# Altium schematic sheet DMX512+6A鋰電充電測試.SchDoc
size A4
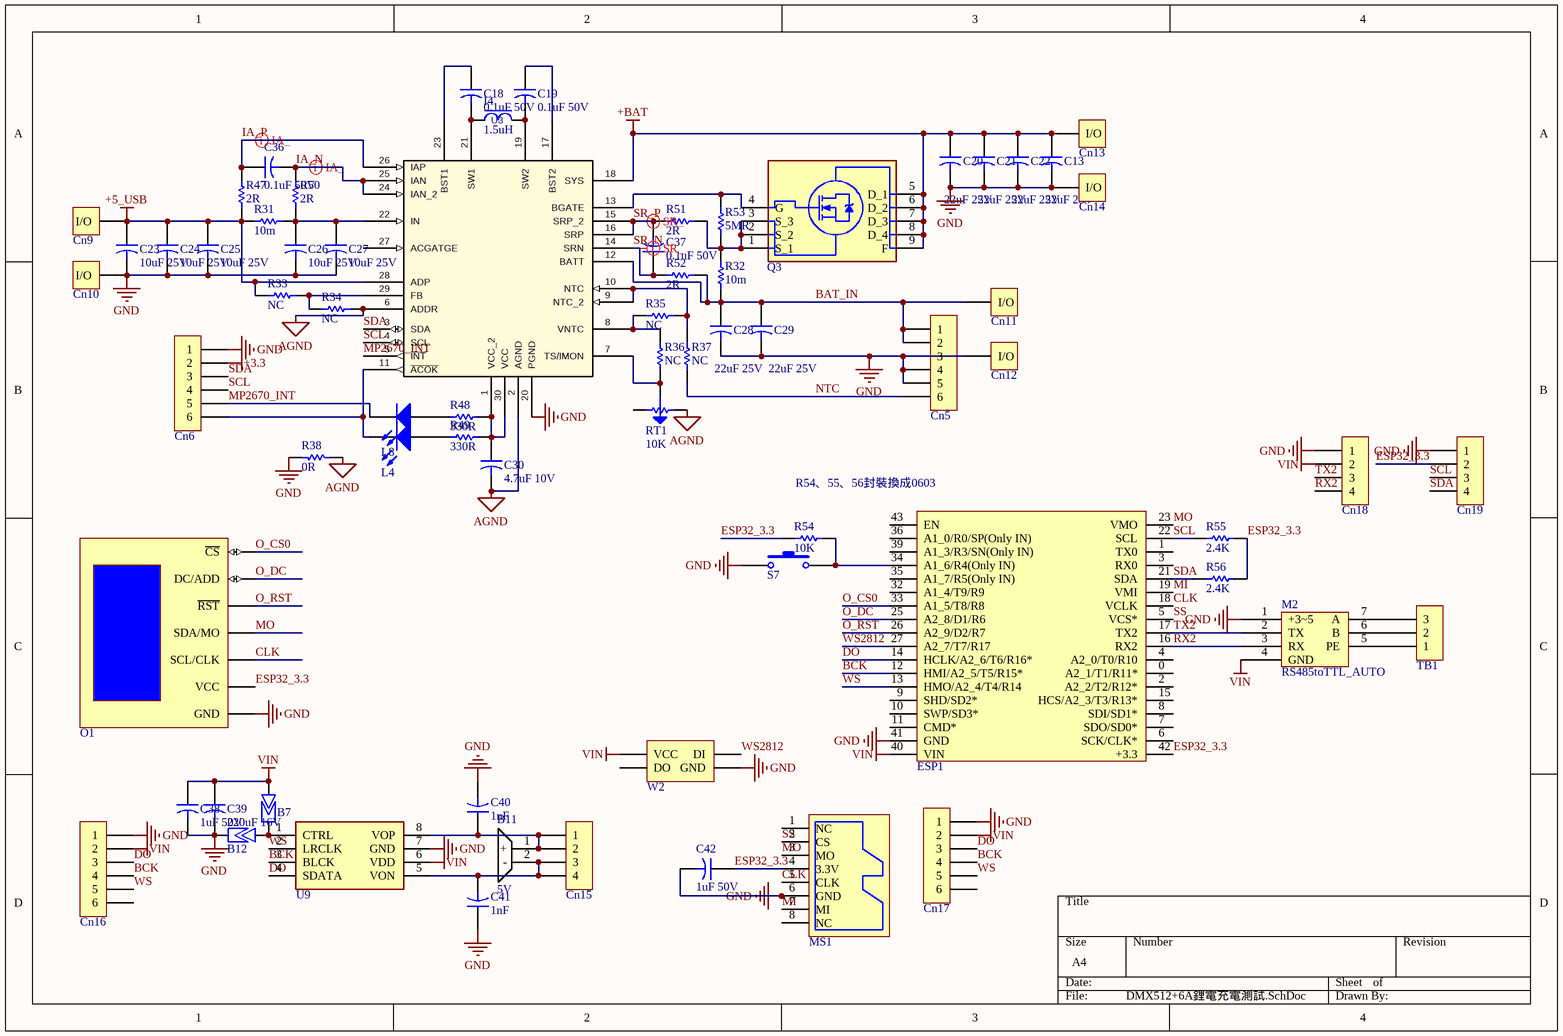
[diagram p0: DMX512+6A鋰電充電測試.SchDoc]

## Parts
B7  不上錫  [BYPASS-0402]  (value not drawn)
B11  5V  [Buzzer_12085]
B12  上錫  [BYPASS-0402]  (value not drawn)
C13  22uF 25V  [Cap SMD-0805]
C18  0.1uF 50V  [Cap SMD-0603]
C19  0.1uF 50V  [Cap SMD-0603]
C20  22uF 25V  [Cap SMD-0805]
C21  22uF 25V  [Cap SMD-0805]
C22  22uF 25V  [Cap SMD-0805]
C23  10uF 25V  [Cap SMD-0805]
C24  10uF 25V  [Cap SMD-0805]
C25  10uF 25V  [Cap SMD-0805]
C26  10uF 25V  [Cap SMD-0805]
C27  10uF 25V  [Cap SMD-0805]
C28  22uF 25V  [Cap SMD-0805]
C29  22uF 25V  [Cap SMD-0805]
C30  4.7uF 10V  [Cap SMD-0603]
C36  0.1uF 50V  [Cap SMD-0603]
C37  0.1uF 50V  [Cap SMD-0603]
C38  1uF 50V  [Cap SMD-0603]
C39  220uF 16V  [CAP SMD-B3528]
C40  1nF  [Cap SMD-0603]
C41  1nF  [Cap SMD-0603]
C42  1uF 50V  [Cap SMD-0603]
Cn5  KF2510-6  [KF2510-6A]  (value not drawn)
Cn6  KF2510-6  [KF2510-6A]  (value not drawn)
Cn9  Contact  [Terminal_Screw]  (value not drawn)
Cn10  Contact  [Terminal_Screw]  (value not drawn)
Cn11  Contact  [Terminal_Screw]  (value not drawn)
Cn12  Contact  [Terminal_Screw]  (value not drawn)
Cn13  Contact  [Terminal_Screw]  (value not drawn)
Cn14  Contact  [Terminal_Screw]  (value not drawn)
Cn15  KF2510-4  [KF2510-4A]  (value not drawn)
Cn16  KF2510-6  [KF2510-6A]  (value not drawn)
Cn17  KF2510-6  [KF2510-6A]  (value not drawn)
Cn18  KF2510-4  [KF2510-4A]  (value not drawn)
Cn19  KF2510-4  [KF2510-4A]  (value not drawn)
ESP1  ESP32_Node32s  [ESP32 Module]  (value not drawn)
I4  1.5uH  [Inductor-1040]
L4  藍  [LED SMD-0603]  (value not drawn)
L8  藍  [LED SMD-0603]  (value not drawn)
M2  RS485toTTL_AUTO  [RS485_AUTO MODULE]
MS1  SD Socket Micro  [SD  CARD SOCKET_Micro]  (value not drawn)
O1  排母 1*7P  [OLED-SPI/I2C]  (value not drawn)
Q3  BSC030N08NS5ATMA1  [TDSON-8]  (value not drawn)
R31  10m  [Res-0201]
R32  10m  [Res-0201]
R33  NC  [Res-0201]
R34  NC  [Res-0201]
R35  NC  [Res-0201]
R36  NC  [Res-0201]
R37  NC  [Res-0201]
R38  0R  [Res-0201]
R47  2R  [Res-0201]
R48  330R  [Res-0201]
R49  330R  [Res-0201]
R50  2R  [Res-0201]
R51  2R  [Res-0201]
R52  2R  [Res-0201]
R53  5MR  [Res-0201]
R54  10K  [Res-0201]
R55  2.4K  [Res-0201]
R56  2.4K  [Res-0201]
RT1  10K  [Res SMD-EVM3ESX50B]
S7  Switch  [Switch SMD-3.6*6*2.5]  (value not drawn)
TB1  HT508R-5.08 _3P  [Terminal block(KF2EDGR-5.08 _3P)]  (value not drawn)
U3  MP2760GVT-010A  [TQFN-30_MP2760_MNP]  (value not drawn)
U9  NS4168  [SOP-8]  (value not drawn)
W2  WS2812B  [LED SMD-WS2812B]  (value not drawn)

## Nets
+3.3: Cn6.2
+5_USB: C23.1 C24.1 C25.1 Cn9.1(I/O) R31.1 R33.1 R47.1 U3.28(ADP)
+BAT: C13.1 C20.1 C21.1 C22.1 Cn13.1(I/O) Q3.5(D_1) Q3.6(D_2) Q3.7(D_3) Q3.8(D_4) Q3.9(F) U3.18(SYS)
AGND: C30.2 R34.2 R38.2 RT1.1 U3.2(AGND) U3.6(ADDR)
GND: B12.1 C13.2 C20.2 C21.2 C22.2 C23.2 C24.2 C25.2 C26.2 C27.2 C28.2 C29.2 C38.2 C39.2 C40.2 C41.1 C42.2 Cn5.3 Cn5.4 Cn5.5 Cn6.1 Cn10.1(I/O) Cn12.1(I/O) Cn14.1(I/O) Cn16.1 Cn17.1 Cn18.1 Cn19.1 ESP1.41(GND) M2.1(+3~5) MS1.6(GND) O1.1(GND) R38.1 S7.1 U3.20(PGND) U9.7(GND) W2.3(GND)
VIN: B7.2 C38.1 C39.1 Cn16.2 Cn17.2 Cn18.2 ESP1.40(VIN) M2.4(GND) U9.6(VDD) W2.1(VCC)
BAT_IN: C28.1 C29.1 Cn5.1 Cn5.2 Cn11.1(I/O) R32.1 R52.1 U3.12(BATT)
BCK: Cn16.4 Cn17.4 ESP1.12(HMI/A2_5/T5/R15*) U9.3(BLCK)
CLK: ESP1.18(VCLK) MS1.5(CLK) O1.3(SCL/CLK)
DO: Cn16.3 Cn17.3 ESP1.14(HCLK/A2_6/T6/R16*) U9.4(SDATA)
ESP32_3.3: C42.1 Cn19.2 ESP1.42(+3.3) MS1.4(3.3V) O1.2(VCC) R54.1 R55.2 R56.2
IA_N: C36.2 R50.2 U3.24(IAN_2) U3.25(IAN)
IA_P: C36.1 R47.2 U3.26(IAP)
MI: ESP1.19(VMI) MS1.7(MI)
MO: ESP1.23(VMO) MS1.3(MO) O1.4(SDA/MO)
MP2670_INT: Cn6.5 L8.1(K) U3.5(~{INT})
NTC: Cn5.6 R37.1
O_CS0: ESP1.33(A1_5/T8/R8) O1.7(~{CS})
O_DC: ESP1.25(A2_8/D1/R6) O1.6(DC/ADD)
O_RST: ESP1.26(A2_9/D2/R7) O1.5(~{RST})
RX2: Cn18.4 ESP1.16(RX2) M2.3(RX)
SCL: Cn6.4 Cn19.3 ESP1.22(SCL) R55.1 U3.4(SCL)
SDA: Cn6.3 Cn19.4 ESP1.21(SDA) R56.1 U3.3(SDA)
SR_N: C37.1 R52.2 U3.14(SRN)
SR_P: C37.2 R51.2 U3.15(SRP_2) U3.16(SRP)
SS: ESP1.5(VCS*) MS1.2(CS)
TX2: Cn18.3 ESP1.17(TX2) M2.2(TX)
WS: Cn16.5 Cn17.5 ESP1.13(HMO/A2_4/T4/R14) U9.2(LRCLK)
WS2812: ESP1.27(A2_7/T7/R17) W2.4(DI)
NetB7_1: B7.1 B12.2 U9.1(CTRL)
NetB11_1: B11.1(+) C40.1 Cn15.1 Cn15.2 U9.8(VOP)
NetB11_2: B11.2(-) C41.2 Cn15.3 Cn15.4 U9.5(VON)
NetC18_1: C18.1 U3.23(BST1)
NetC18_2: C18.2 I4.1 U3.21(SW1)
NetC19_1: C19.1 U3.17(BST2)
NetC19_2: C19.2 I4.2 U3.19(SW2)
NetC26_1: C26.1 C27.1 R31.2 R50.1 U3.22(IN)
NetC30_1: C30.1 R48.1 R49.2 U3.1(VCC_2) U3.30(VCC)
NetCn6_6: Cn6.6 L4.1(K) U3.11(~{ACOK})
NetESP1_34: ESP1.34(A1_6/R4(Only_IN)) R54.2 S7.2
NetL4_2: L4.2(A) R49.1
NetL8_2: L8.2(A) R48.2
NetM2_5: M2.5(PE) TB1.1
NetM2_6: M2.6(B) TB1.2
NetM2_7: M2.7(A) TB1.3
NetQ3_1: Q3.1(S_1) Q3.2(S_2) Q3.3(S_3) R32.2 R51.1 R53.1
NetQ3_4: Q3.4(G) R53.2 U3.13(BGATE)
NetR33_2: R33.2 R34.1 U3.29(FB)
NetR35_1: R35.1 R36.2 U3.8(VNTC)
NetR35_2: R35.2 R37.2 U3.9(NTC_2) U3.10(NTC)
NetR36_1: R36.1 RT1.3(TAP) U3.7(TS/IMON)

Not connected (* = marked no-connect by the designer): Cn16 6; Cn17 6; ESP1 0(A2_1/T1/R11*) 1(TX0) 2(A2_2/T2/R12*) 3(RX0) 4(A2_0/T0/R10) 6(SCK/CLK*) 7(SDO/SD0*) 8(SDI/SD1*) 9(SHD/SD2*) 10(SWP/SD3*) 11(CMD*) 15(HCS/A2_3/T3/R13*) 32(A1_4/T9/R9) 35(A1_7/R5(Only_IN)) 36(A1_0/R0/SP(Only_IN)) 39(A1_3/R3/SN(Only_IN)) 43(EN); MS1 1(NC) 8(NC); RT1 2; U3 27(ACGATGE); W2 2(DO)

## Layout directives
differential pair: IA_N, IA_P, SR_N, SR_P

## Notes on the sheet
- R54、55、56封裝換成0603

## Library data of the parts
B7 B12 = Bypass: 短路焊點
B11 = Buzzer: 無源蜂鳴器
C13 C18-C30 C36-C42 = Cap: 電容
  C23-C27 C30 C36 C37: ComponentLink1Description: datasheet; ComponentLink1URL: chrome-extension://efaidnbmnnnibpcajpcglclefindmkaj/https://product.tdk.com/system/files/dam/doc/product/capacitor/ceramic/mlcc/catalog/mlcc_commercial_general_en.pdf
  C38-C41: ComponentLink1Description: datasheet; ComponentLink1URL: https://product.tdk.com/system/files/dam/doc/product/capacitor/ceramic/mlcc/catalog/mlcc_commercial_general_en.pdf
Cn5 Cn6 Cn16 Cn17 = Contact(6P): 接線端子
Cn9-Cn14 = Contact: 接線端子、接點、郵票孔
Cn15 Cn18 Cn19 = Contact(4P): 接線端子
ESP1 = ESP32_Node32s: WIFI通訊模組
I4 = Inductor: 一體成型電感
L4 L8 = LED
M2 = RS485toTTL_AUTO: TTLtoRS485
MS1 = SD Socket Micro: Micro SD 卡座
O1 = OLED_SPI/I2C: OLED-SSD1306
Q3 = MOS_N_TDSON-8: 場效電晶體_N; Manufacturer_Name: Infineon; Datasheet Link: https://componentsearchengine.com//BSC030N08NS5ATMA1.pdf; Height: 1mm; Mouser2 Part Number: 726-BSC030N08NS5ATMA; Mouser2 Price/Stock: https://www.mouser.com/Search/Refine.aspx?Keyword=726-BSC030N08NS5ATMA; Manufacturer_Part_Number: BSC030N08NS5ATMA1
R31-R38 R47-R56 = Res: 電阻
RT1 = Res-Tap: 電阻_可變
S7 = Switch: 開關_按鍵
TB1 = Terminal block(3P): 端子台
U3 = MP2760GVT: 集成 NVDC 电源路径管理的1-4节电池升降压充电IC; Mfr_Name: Monolithic Power Systems; Value: MP2760GVT-0000-P; C: Copyright (C) 2021 Accelerated Designs. All rights reserved; #1: 當輸入缺失時，MP2760可以以反向方式運作，通過I2C/SMBus控制從電池為輸入提供電源。; #2: 當輸入缺失且源模式被禁用時，MP2760以待機模式運作。在待機模式中，系統通過外部電池FET（BATFET）由電池供電。; Copyright: Copyright (C) 2023 Ultra Librarian. All rights reserved.; Manufacturer_Part_Number: MP2760GVT-0000-P; ComponentLink1Description: datasheet; ComponentLink1URL: https://www.monolithicpower.cn/cn/documentview/productdocument/index/version/2/document_type/Datasheet/lang/en/sku/MP2760GVT/document_id/9800/
U9 = NS4168: I2S音频功率放大器; ComponentLink1Description: datssheet; ComponentLink1URL: http://www.szczkjgs.com/UploadFiles/fujian/3725/NS4168.pdf
W2 = WS2812B: LED_可控燈珠